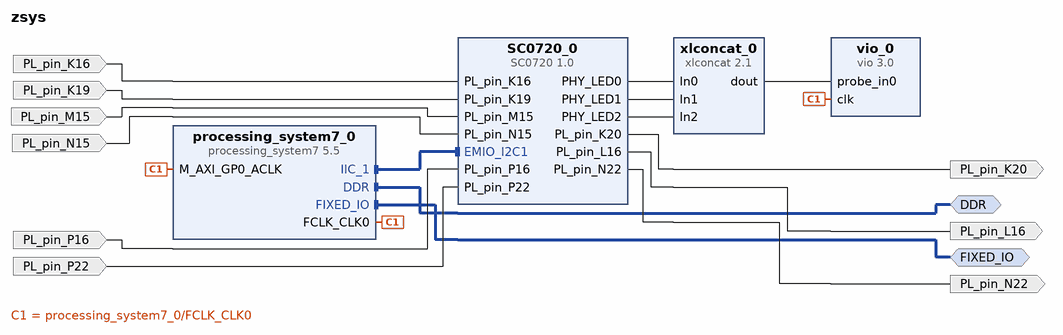
[diagram p0: block diagram of the top level]
# Vivado block design zsys, xa7z020clg484-1Q, Vivado 2025.2
create_bd_design zsys

create_bd_intf_port -mode Master -vlnv xilinx.com:interface:ddrx_rtl:1.0 DDR
create_bd_intf_port -mode Master -vlnv xilinx.com:display_processing_system7:fixedio_rtl:1.0 FIXED_IO
create_bd_port -dir I PL_pin_K16
create_bd_port -dir I PL_pin_K19
create_bd_port -dir O PL_pin_K20
create_bd_port -dir O PL_pin_L16
create_bd_port -dir I PL_pin_M15
create_bd_port -dir I PL_pin_N15
create_bd_port -dir O PL_pin_N22
create_bd_port -dir I PL_pin_P16
create_bd_port -dir I PL_pin_P22

create_bd_cell -type ip -vlnv trenz.biz:user:SC0720:1.0 SC0720_0
create_bd_cell -type ip -vlnv xilinx.com:ip:processing_system7:5.5 processing_system7_0
set_property -dict [list \
  CONFIG.PCW_ENET0_ENET0_IO {MIO 16 .. 27} \
  CONFIG.PCW_ENET0_GRP_MDIO_ENABLE 1 \
  CONFIG.PCW_ENET0_GRP_MDIO_IO {MIO 52 .. 53} \
  CONFIG.PCW_ENET0_PERIPHERAL_ENABLE 1 \
  CONFIG.PCW_ENET_RESET_ENABLE 0 \
  CONFIG.PCW_FPGA0_PERIPHERAL_FREQMHZ 100 \
  CONFIG.PCW_GPIO_MIO_GPIO_ENABLE 1 \
  CONFIG.PCW_GPIO_MIO_GPIO_IO MIO \
  CONFIG.PCW_I2C0_GRP_INT_ENABLE 0 \
  CONFIG.PCW_I2C0_I2C0_IO {MIO 10 .. 11} \
  CONFIG.PCW_I2C0_PERIPHERAL_ENABLE 1 \
  CONFIG.PCW_I2C1_I2C1_IO EMIO \
  CONFIG.PCW_I2C1_PERIPHERAL_ENABLE 1 \
  CONFIG.PCW_I2C_PERIPHERAL_FREQMHZ 111.111115 \
  CONFIG.PCW_I2C_RESET_ENABLE 0 \
  CONFIG.PCW_PRESET_BANK1_VOLTAGE {LVCMOS 1.8V} \
  CONFIG.PCW_QSPI_GRP_FBCLK_ENABLE 1 \
  CONFIG.PCW_QSPI_GRP_FBCLK_IO {MIO 8} \
  CONFIG.PCW_QSPI_GRP_SINGLE_SS_ENABLE 1 \
  CONFIG.PCW_QSPI_GRP_SINGLE_SS_IO {MIO 1 .. 6} \
  CONFIG.PCW_QSPI_PERIPHERAL_ENABLE 1 \
  CONFIG.PCW_QSPI_QSPI_IO {MIO 1 .. 6} \
  CONFIG.PCW_SD0_GRP_CD_ENABLE 0 \
  CONFIG.PCW_SD0_GRP_WP_ENABLE 0 \
  CONFIG.PCW_SD0_PERIPHERAL_ENABLE 1 \
  CONFIG.PCW_SD0_SD0_IO {MIO 40 .. 45} \
  CONFIG.PCW_SD1_PERIPHERAL_ENABLE 1 \
  CONFIG.PCW_SD1_SD1_IO {MIO 46 .. 51} \
  CONFIG.PCW_SDIO_PERIPHERAL_FREQMHZ 100 \
  CONFIG.PCW_SINGLE_QSPI_DATA_MODE x4 \
  CONFIG.PCW_TTC0_PERIPHERAL_ENABLE 1 \
  CONFIG.PCW_TTC0_TTC0_IO EMIO \
  CONFIG.PCW_TTC1_PERIPHERAL_ENABLE 1 \
  CONFIG.PCW_TTC1_TTC1_IO EMIO \
  CONFIG.PCW_UART0_PERIPHERAL_ENABLE 1 \
  CONFIG.PCW_UART0_UART0_IO {MIO 14 .. 15} \
  CONFIG.PCW_UART1_PERIPHERAL_ENABLE 1 \
  CONFIG.PCW_UART1_UART1_IO {MIO 12 .. 13} \
  CONFIG.PCW_UART_PERIPHERAL_FREQMHZ 100 \
  CONFIG.PCW_UIPARAM_DDR_PARTNO {MT41J256M16 RE-125} \
  CONFIG.PCW_USB0_PERIPHERAL_ENABLE 1 \
  CONFIG.PCW_USB0_USB0_IO {MIO 28 .. 39} \
  CONFIG.PCW_USB_RESET_ENABLE 0 \
  CONFIG.PCW_WDT_PERIPHERAL_ENABLE 1 \
  CONFIG.PCW_WDT_WDT_IO EMIO \
] [get_bd_cells processing_system7_0]
# 225 more settings of processing_system7_0 are not shown: defaults, MIO pin electricals, DDR timing, and values the tool derives
create_bd_cell -type ip -vlnv xilinx.com:ip:vio:3.0 vio_0
set_property -dict {CONFIG.C_NUM_PROBE_OUT 0} [get_bd_cells vio_0]
create_bd_cell -type ip -vlnv xilinx.com:ip:xlconcat:2.1 xlconcat_0
set_property -dict {CONFIG.NUM_PORTS 3} [get_bd_cells xlconcat_0]

# ---- connections ----

connect_bd_intf_net [get_bd_intf_ports DDR] [get_bd_intf_pins processing_system7_0/DDR]
connect_bd_intf_net [get_bd_intf_ports FIXED_IO] [get_bd_intf_pins processing_system7_0/FIXED_IO]
connect_bd_intf_net [get_bd_intf_pins SC0720_0/EMIO_I2C1] [get_bd_intf_pins processing_system7_0/IIC_1]
connect_bd_net -net PHY_LEDs [get_bd_pins xlconcat_0/dout] [get_bd_pins vio_0/probe_in0]
connect_bd_net -net PL_pin_K16_1 [get_bd_ports PL_pin_K16] [get_bd_pins SC0720_0/PL_pin_K16]
connect_bd_net -net PL_pin_K19_1 [get_bd_ports PL_pin_K19] [get_bd_pins SC0720_0/PL_pin_K19]
connect_bd_net -net PL_pin_M15_1 [get_bd_ports PL_pin_M15] [get_bd_pins SC0720_0/PL_pin_M15]
connect_bd_net -net PL_pin_N15_1 [get_bd_ports PL_pin_N15] [get_bd_pins SC0720_0/PL_pin_N15]
connect_bd_net -net PL_pin_P16_1 [get_bd_ports PL_pin_P16] [get_bd_pins SC0720_0/PL_pin_P16]
connect_bd_net -net PL_pin_P22_1 [get_bd_ports PL_pin_P22] [get_bd_pins SC0720_0/PL_pin_P22]
connect_bd_net [get_bd_pins SC0720_0/PHY_LED0] [get_bd_pins xlconcat_0/In0]
connect_bd_net [get_bd_pins SC0720_0/PHY_LED1] [get_bd_pins xlconcat_0/In1]
connect_bd_net [get_bd_pins SC0720_0/PHY_LED2] [get_bd_pins xlconcat_0/In2]
connect_bd_net [get_bd_pins SC0720_0/PL_pin_K20] [get_bd_ports PL_pin_K20]
connect_bd_net [get_bd_pins SC0720_0/PL_pin_L16] [get_bd_ports PL_pin_L16]
connect_bd_net [get_bd_pins SC0720_0/PL_pin_N22] [get_bd_ports PL_pin_N22]
connect_bd_net [get_bd_pins processing_system7_0/FCLK_CLK0] [get_bd_pins processing_system7_0/M_AXI_GP0_ACLK] [get_bd_pins vio_0/clk]

validate_bd_design
save_bd_design
